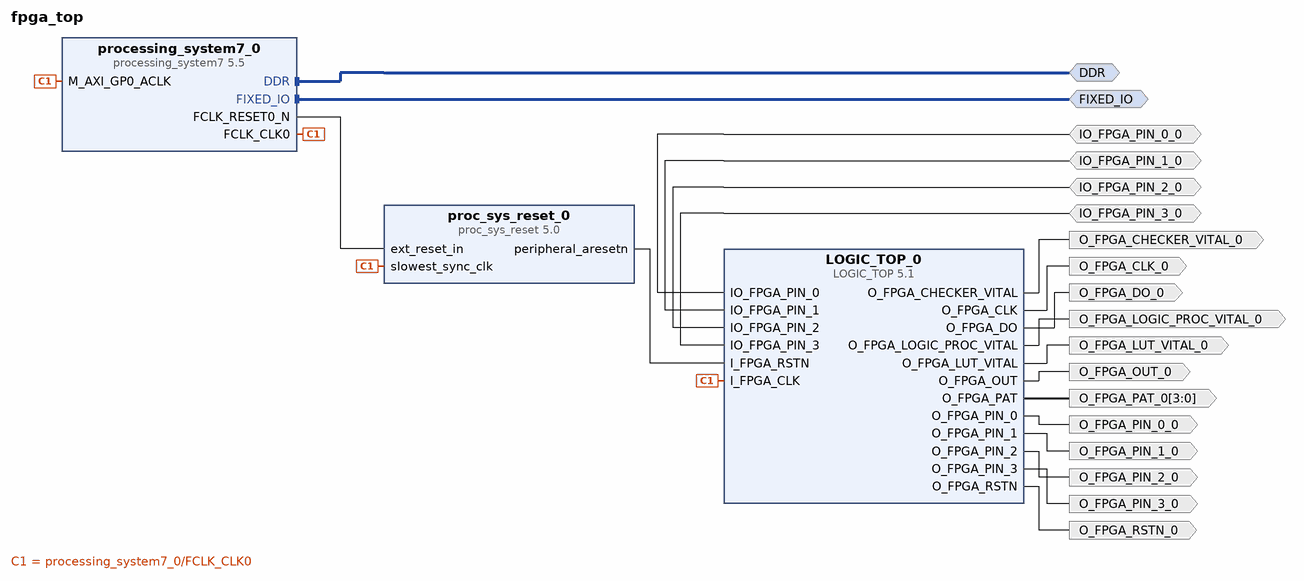
[diagram p0: block diagram of the top level]
# Vivado block design fpga_top, xc7z020clg484-1, Vivado 2021.2
create_bd_design fpga_top

create_bd_intf_port -mode Master -vlnv xilinx.com:interface:ddrx_rtl:1.0 DDR
create_bd_intf_port -mode Master -vlnv xilinx.com:display_processing_system7:fixedio_rtl:1.0 FIXED_IO
create_bd_port -dir IO IO_FPGA_PIN_0_0
create_bd_port -dir IO IO_FPGA_PIN_1_0
create_bd_port -dir IO IO_FPGA_PIN_2_0
create_bd_port -dir IO IO_FPGA_PIN_3_0
create_bd_port -dir O -type clk O_FPGA_CLK_0
create_bd_port -dir O -type rst O_FPGA_RSTN_0
create_bd_port -dir O O_FPGA_LUT_VITAL_0
create_bd_port -dir O O_FPGA_CHECKER_VITAL_0
create_bd_port -dir O O_FPGA_LOGIC_PROC_VITAL_0
create_bd_port -dir O O_FPGA_PIN_0_0
create_bd_port -dir O O_FPGA_PIN_1_0
create_bd_port -dir O O_FPGA_PIN_2_0
create_bd_port -dir O O_FPGA_PIN_3_0
create_bd_port -dir O -from 3 -to 0 O_FPGA_PAT_0
create_bd_port -dir O O_FPGA_OUT_0
create_bd_port -dir O O_FPGA_DO_0

create_bd_cell -type ip -vlnv xilinx.com:ip:processing_system7:5.5 processing_system7_0
set_property -dict [list \
  CONFIG.PCW_APU_PERIPHERAL_FREQMHZ 666.666667 \
  CONFIG.PCW_ENET0_ENET0_IO {MIO 16 .. 27} \
  CONFIG.PCW_ENET0_GRP_MDIO_ENABLE 1 \
  CONFIG.PCW_ENET0_GRP_MDIO_IO {MIO 52 .. 53} \
  CONFIG.PCW_ENET0_PERIPHERAL_ENABLE 1 \
  CONFIG.PCW_ENET0_RESET_ENABLE 0 \
  CONFIG.PCW_ENET_RESET_ENABLE 1 \
  CONFIG.PCW_ENET_RESET_SELECT {Share reset pin} \
  CONFIG.PCW_FPGA0_PERIPHERAL_FREQMHZ 1.000000 \
  CONFIG.PCW_FPGA1_PERIPHERAL_FREQMHZ 150.000000 \
  CONFIG.PCW_GPIO_MIO_GPIO_ENABLE 1 \
  CONFIG.PCW_GPIO_MIO_GPIO_IO MIO \
  CONFIG.PCW_I2C_RESET_ENABLE 1 \
  CONFIG.PCW_PRESET_BANK1_VOLTAGE {LVCMOS 1.8V} \
  CONFIG.PCW_QSPI_GRP_SINGLE_SS_ENABLE 1 \
  CONFIG.PCW_QSPI_GRP_SINGLE_SS_IO {MIO 1 .. 6} \
  CONFIG.PCW_QSPI_PERIPHERAL_ENABLE 1 \
  CONFIG.PCW_QSPI_QSPI_IO {MIO 1 .. 6} \
  CONFIG.PCW_SD0_GRP_CD_ENABLE 1 \
  CONFIG.PCW_SD0_GRP_CD_IO {MIO 47} \
  CONFIG.PCW_SD0_GRP_WP_ENABLE 1 \
  CONFIG.PCW_SD0_GRP_WP_IO {MIO 46} \
  CONFIG.PCW_SD0_PERIPHERAL_ENABLE 1 \
  CONFIG.PCW_SD0_SD0_IO {MIO 40 .. 45} \
  CONFIG.PCW_SDIO_PERIPHERAL_FREQMHZ 50 \
  CONFIG.PCW_SINGLE_QSPI_DATA_MODE x4 \
  CONFIG.PCW_TTC0_PERIPHERAL_ENABLE 1 \
  CONFIG.PCW_TTC0_TTC0_IO EMIO \
  CONFIG.PCW_UART1_PERIPHERAL_ENABLE 1 \
  CONFIG.PCW_UART1_UART1_IO {MIO 48 .. 49} \
  CONFIG.PCW_UART_PERIPHERAL_FREQMHZ 50 \
  CONFIG.PCW_UIPARAM_DDR_FREQ_MHZ 533.333313 \
  CONFIG.PCW_UIPARAM_DDR_PARTNO {MT41J128M16 HA-15E} \
  CONFIG.PCW_USB0_PERIPHERAL_ENABLE 1 \
  CONFIG.PCW_USB0_RESET_ENABLE 0 \
  CONFIG.PCW_USB0_USB0_IO {MIO 28 .. 39} \
  CONFIG.PCW_USB_RESET_ENABLE 1 \
  CONFIG.PCW_USB_RESET_SELECT {Share reset pin} \
  CONFIG.preset ZedBoard \
] [get_bd_cells processing_system7_0]
# 223 more settings of processing_system7_0 are not shown: defaults, MIO pin electricals, DDR timing, and values the tool derives
create_bd_cell -type ip -vlnv xilinx.com:ip:proc_sys_reset:5.0 proc_sys_reset_0
create_bd_cell -type ip -vlnv user.org:user:LOGIC_TOP:5.1 LOGIC_TOP_0

# ---- connections ----

connect_bd_intf_net [get_bd_intf_ports DDR] [get_bd_intf_pins processing_system7_0/DDR]
connect_bd_intf_net [get_bd_intf_ports FIXED_IO] [get_bd_intf_pins processing_system7_0/FIXED_IO]
connect_bd_net [get_bd_pins LOGIC_TOP_0/O_FPGA_CHECKER_VITAL] [get_bd_ports O_FPGA_CHECKER_VITAL_0]
connect_bd_net [get_bd_pins LOGIC_TOP_0/O_FPGA_CLK] [get_bd_ports O_FPGA_CLK_0]
connect_bd_net [get_bd_pins LOGIC_TOP_0/O_FPGA_DO] [get_bd_ports O_FPGA_DO_0]
connect_bd_net [get_bd_pins LOGIC_TOP_0/O_FPGA_LOGIC_PROC_VITAL] [get_bd_ports O_FPGA_LOGIC_PROC_VITAL_0]
connect_bd_net [get_bd_pins LOGIC_TOP_0/O_FPGA_LUT_VITAL] [get_bd_ports O_FPGA_LUT_VITAL_0]
connect_bd_net [get_bd_pins LOGIC_TOP_0/O_FPGA_OUT] [get_bd_ports O_FPGA_OUT_0]
connect_bd_net [get_bd_pins LOGIC_TOP_0/O_FPGA_PAT] [get_bd_ports O_FPGA_PAT_0]
connect_bd_net [get_bd_pins LOGIC_TOP_0/O_FPGA_PIN_0] [get_bd_ports O_FPGA_PIN_0_0]
connect_bd_net [get_bd_pins LOGIC_TOP_0/O_FPGA_PIN_1] [get_bd_ports O_FPGA_PIN_1_0]
connect_bd_net [get_bd_pins LOGIC_TOP_0/O_FPGA_PIN_2] [get_bd_ports O_FPGA_PIN_2_0]
connect_bd_net [get_bd_pins LOGIC_TOP_0/O_FPGA_PIN_3] [get_bd_ports O_FPGA_PIN_3_0]
connect_bd_net [get_bd_pins LOGIC_TOP_0/O_FPGA_RSTN] [get_bd_ports O_FPGA_RSTN_0]
connect_bd_net [get_bd_ports IO_FPGA_PIN_0_0] [get_bd_pins LOGIC_TOP_0/IO_FPGA_PIN_0]
connect_bd_net [get_bd_ports IO_FPGA_PIN_1_0] [get_bd_pins LOGIC_TOP_0/IO_FPGA_PIN_1]
connect_bd_net [get_bd_ports IO_FPGA_PIN_2_0] [get_bd_pins LOGIC_TOP_0/IO_FPGA_PIN_2]
connect_bd_net [get_bd_ports IO_FPGA_PIN_3_0] [get_bd_pins LOGIC_TOP_0/IO_FPGA_PIN_3]
connect_bd_net [get_bd_pins proc_sys_reset_0/peripheral_aresetn] [get_bd_pins LOGIC_TOP_0/I_FPGA_RSTN]
connect_bd_net [get_bd_pins processing_system7_0/FCLK_CLK0] \
  [get_bd_pins processing_system7_0/M_AXI_GP0_ACLK] [get_bd_pins proc_sys_reset_0/slowest_sync_clk] \
  [get_bd_pins LOGIC_TOP_0/I_FPGA_CLK]
connect_bd_net [get_bd_pins processing_system7_0/FCLK_RESET0_N] [get_bd_pins proc_sys_reset_0/ext_reset_in]

validate_bd_design
save_bd_design
